# Altium schematic sheet Xbee_Avionics_Board.SchDoc: Xbee Avionics Board
size A3; Author: Adam R. Lehman / Daniel Mitchell; SheetNumber: 6; SheetTotal: 6
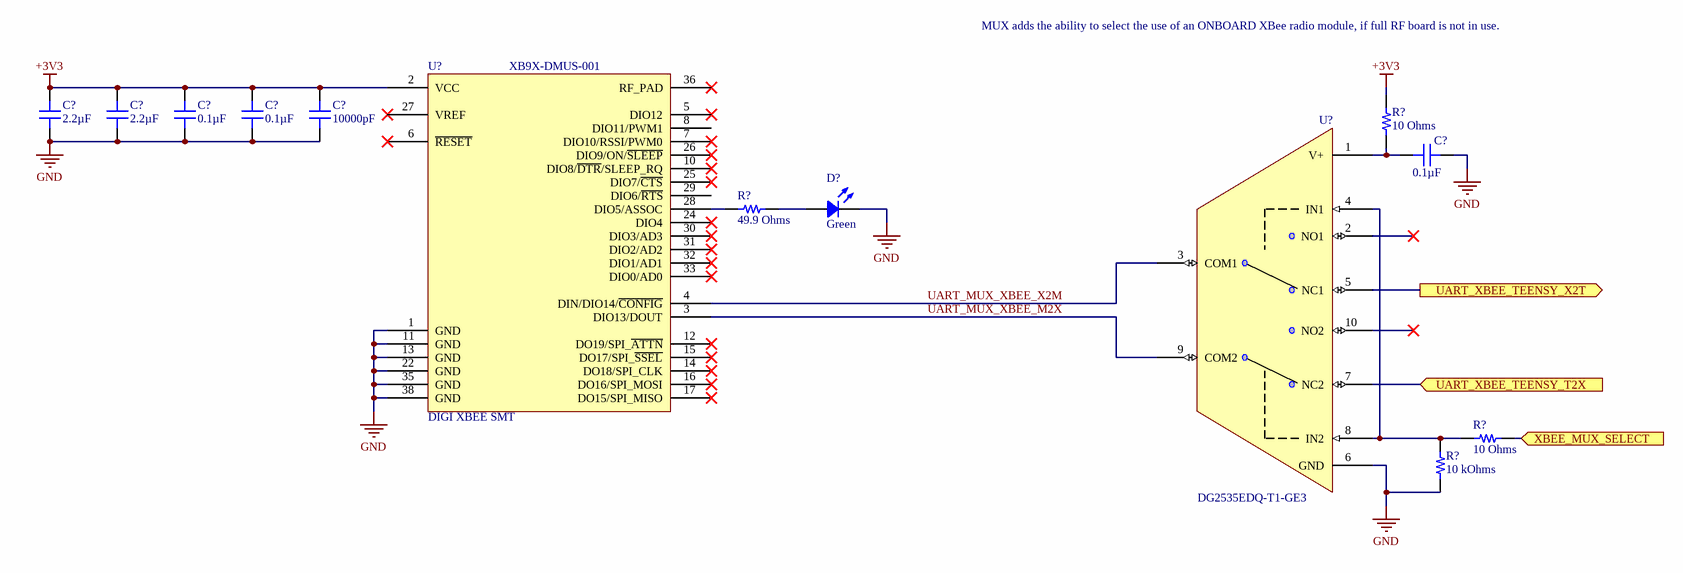
[diagram p0: Xbee_Avionics_Board.SchDoc]

## Parts
(Parts that share a designator on the sheet are numbered #1, #2 ... from top to bottom, then left to right.)
C?#1  2.2µF  [CAP 0603_1608]
C?#2  2.2µF  [CAP 0603_1608]
C?#3  0.1µF  [CAP 0603_1608]
C?#4  0.1µF  [CAP 0603_1608]
C?#5  10000pF  [CAP 0603_1608]
C?#6  0.1µF  [CAP 0603_1608]
D?  Green  [LED 0603_1608 GREEN]
R?#1  10 Ohms  [RES 0603_1608]
R?#2  49.9 Ohms  [RES 0603_1608]
R?#3  10 Ohms  [RES 0603_1608]
R?#4  10 kOhms  [RES 0603_1608]
U?#1  DIGI XBEE SMT  Part Number: XB9X-DMUS-001  [*XCVR_XBP9X-DMUS-001]
U?#2  DG2535EDQ-T1-GE3

## Ports
UART_XBEE_TEENSY_T2X (in), UART_XBEE_TEENSY_X2T (out), XBEE_MUX_SELECT (in)

## Nets
+3V3: C?#1.1 C?#2.1 C?#3.1 C?#4.1 C?#5.2 R?#1.2 U?#1.2(VCC)
GND: C?#1.2 C?#2.2 C?#3.2 C?#4.2 C?#5.1 C?#6.2 D?.2 R?#4.1 U?#1.1(GND) U?#1.11(GND) U?#1.13(GND) U?#1.22(GND) U?#1.35(GND) U?#1.38(GND) U?#2.6(GND)
UART_MUX_XBEE_M2X: U?#1.3(DIO13/DOUT) U?#2.9(COM2)
UART_MUX_XBEE_X2M: U?#1.4(DIN/DIO14/~{CONFIG}) U?#2.3(COM1)
UART_XBEE_TEENSY_T2X: U?#2.7(NC2) ; port UART_XBEE_TEENSY_T2X
UART_XBEE_TEENSY_X2T: U?#2.5(NC1) ; port UART_XBEE_TEENSY_X2T
XBEE_MUX_SELECT: R?#3.1 ; port XBEE_MUX_SELECT
NetC?#6_1: C?#6.1 R?#1.1 U?#2.1(V+)
NetD?_1: D?.1 R?#2.2
NetR?#2_1: R?#2.1 U?#1.28(DIO5/ASSOC)
NetR?#3_2: R?#3.2 R?#4.2 U?#2.4(IN1) U?#2.8(IN2)

Not connected (* = marked no-connect by the designer): U?#1 5(DIO12)* 6(~{RESET})* 7(DIO10/RSSI/PWM0)* 8(DIO11/PWM1) 10(DIO8/~{DTR}/SLEEP_RQ)* 12(DO19/SPI_~{ATTN})* 14(DO18/SPI_CLK)* 15(DO17/SPI_~{SSEL})* 16(DO16/SPI_MOSI)* 17(DO15/SPI_MISO)* 24(DIO4)* 25(DIO7/~{CTS})* 26(DIO9/ON/~{SLEEP})* 27(VREF)* 29(DIO6/~{RTS}) 30(DIO3/AD3)* 31(DIO2/AD2)* 32(DIO1/AD1)* 33(DIO0/AD0)* 36(RF_PAD)*; U?#2 2(NO1)* 10(NO2)*

## Notes on the sheet
- MUX adds the ability to select the use of an ONBOARD XBee radio module, if full RF board is not in use.
- Title
- Size:
- Date:
- A4
- Author
- Time:
- Sheet
- Revision:
- of
- RIT Space Exploration Team
- Rochester Institute of Technology
- 1 Lomb Memorial Drive
- Rochester, NY 14623
- https://spex.rit.edu
- File:

## Library data of the parts
C?#1 C?#2 = GRM188R71A225KE15D: CAP CER 2.2UF 10V X7R 0603; Manufacturer: Murata Electronics; Tolerance: ±10%; Part Number: GRM188R71A225KE15D; Value: 2.2µF; Applications: General Purpose; Capacitance: 2.2µF; ComponentLink1Description: Datasheet; ComponentLink1URL: https://www.murata.com/~/media/webrenewal/support/library/catalog/products/capacitor/mlcc/c02e.ashx?la=en-us; ComponentLink2Description: DigiKey Link; ComponentLink2URL: http://digikey.com/product-detail/en/murata-electronics/GRM188R71A225KE15D/490-4520-1-ND/1033279; Device Package: 0603 (1608 Metric); LastUpdated: 1/21/2020 12:02:07 AM; Lifecycle Status: Active; Minimum Order: 1; Mounting Type: Surface Mount, MLCC; Operating Temperature: -55°C ~ 125°C; Package / Case: 0603 (1608 Metric); Packaging: TapeAndReel; PartId: 3946; Part Status: Active; Price: 0.05; Series: GRM; Size / Dimension: 0.063" L x 0.031" W (1.60mm x 0.80mm); Supplier 1: DigiKey; Supplier Part Number 1: 490-4520-1-ND; Temperature Coefficient: X7R; Thickness (Max): 0.035" (0.90mm); Voltage - Rated: 10V
C?#3 C?#4 C?#6 = 100X14W104MV4T: CAP CER 0.1UF 10V X7R 0603; Manufacturer: Johanson Dielectrics Inc.; Tolerance: ±20%; Part Number: 100X14W104MV4T; Value: 0.1µF; Applications: Bypass, Decoupling; Capacitance: 0.1µF; ComponentLink1Description: Datasheet; ComponentLink1URL: https://www.johansondielectrics.com/downloads/x2y-filter-and-decoupling-capacitors.pdf; ComponentLink2Description: DigiKey Link; ComponentLink2URL: http://digikey.com/product-detail/en/johanson-dielectrics-inc/100X14W104MV4T/709-1101-1-ND/1655915; Device Package: 0603 (1608 Metric); Features: Low ESL (X2Y); LastUpdated: 1/21/2020 12:02:09 AM; Lifecycle Status: Active; Minimum Order: 1; Mounting Type: Surface Mount, MLCC; Operating Temperature: -55°C ~ 125°C; Package / Case: 0603 (1608 Metric); Packaging: TapeAndReel; PartId: 2680; Part Status: Active; Price: 0.11; Series: X2Y®; Size / Dimension: 0.064" L x 0.035" W (1.63mm x 0.89mm); Supplier 1: DigiKey; Supplier Part Number 1: 709-1101-1-ND; Temperature Coefficient: X7R; Thickness (Max): 0.026" (0.66mm); Voltage - Rated: 10V
C?#5 = C0603S103K4RACTU: CAP CER 10000PF 16V X7R 0603; Manufacturer: KEMET; Tolerance: ±10%; Part Number: C0603S103K4RACTU; Value: 10000pF; Applications: Boardflex Sensitive; Capacitance: 10000pF; ComponentLink1Description: Datasheet; ComponentLink1URL: https://api.kemet.com/component-edge/download/datasheet/C0603S103K4RACTU.pdf; ComponentLink2Description: DigiKey Link; ComponentLink2URL: http://digikey.com/product-detail/en/kemet/C0603S103K4RACTU/399-9135-1-ND/3522653; Device Package: 0603 (1608 Metric); Features: Floating Electrode; LastUpdated: 1/21/2020 12:02:08 AM; Lifecycle Status: Active; Minimum Order: 1; Mounting Type: Surface Mount, MLCC; Operating Temperature: -55°C ~ 125°C; Package / Case: 0603 (1608 Metric); Packaging: TapeAndReel; PartId: 3312; Part Status: Active; Price: 0.07; Series: SMD Comm X7R FE; Size / Dimension: 0.063" L x 0.031" W (1.60mm x 0.80mm); Supplier 1: DigiKey; Supplier Part Number 1: 399-9135-1-ND; Temperature Coefficient: X7R; Thickness (Max): 0.034" (0.87mm); Voltage - Rated: 16V
D? = LT Q39G-Q1OO-25-1: LED GREEN DIFFUSED 0603 SMD; Manufacturer: OSRAM Opto Semiconductors Inc.; Configuration: Standard; Current - Test: 5mA; Lens Color: White; Lens Size: 1.10mm x 0.80mm; Lens Style: Rectangle with Flat Top; Millicandela Rating: 175.5mcd; Viewing Angle: 170°, 130°; Voltage - Forward (Vf) (Typ): 2.85V; Wavelength - Dominant: 530nm; Wavelength - Peak: 525nm; Part Number: LT Q39G-Q1OO-25-1; Color: Green; ComponentLink1Description: Datasheet; ComponentLink1URL: https://dammedia.osram.info/media/resource/hires/osram-dam-2493418/LT%20Q39G.pdf; ComponentLink2Description: DigiKey Link; ComponentLink2URL: http://digikey.com/product-detail/en/osram-opto-semiconductors-inc/LT-Q39G-Q1OO-25-1/475-3442-1-ND/7908059; Device Package: 0603 (1608 Metric); Height (Max): 0.40mm; LastUpdated: 1/21/2020 3:12:08 AM; Lens Transparency: Diffused; Lifecycle Status: Active; Minimum Order: 1; Mounting Type: Surface Mount; Package / Case: 0603 (1608 Metric); Packaging: TapeAndReel; PartId: 689; Part Status: Active; Price: 0.08; Series: CHIPLED 0603; Size / Dimension: 1.60mm L x 0.80mm W; Supplier 1: DigiKey; Supplier Part Number 1: 475-3442-1-ND; Supplier Device Package: 0603; Value: Green
R?#1 R?#3 = CRGCQ0603F10R: CRGCQ 0603 10R 1%; Manufacturer: TE Connectivity Passive Product; Power (Watts): 0.1W, 1/10W; Temperature Coefficient: ±400ppm/°C; Part Number: CRGCQ0603F10R; Value: 10 Ohms; ComponentLink1Description: Datasheet; ComponentLink1URL: https://www.te.com/commerce/DocumentDelivery/DDEController?Action=srchrtrv&DocNm=1773204-3&DocType=DS&DocLang=English; ComponentLink2Description: DigiKey Link; ComponentLink2URL: http://digikey.com/product-detail/en/te-connectivity-passive-product/CRGCQ0603F10R/A129664CT-ND/8577496; Composition: Thick Film; Device Package: 0603 (1608 Metric); Features: Automotive AEC-Q200, Moisture Resistant; Height - Seated (Max): 0.022" (0.55mm); LastUpdated: 1/21/2020 12:16:31 AM; Lifecycle Status: Active; Minimum Order: 1; Number of Terminations: 2; Operating Temperature: -55°C ~ 155°C; Package / Case: 0603 (1608 Metric); Packaging: CutTape; PartId: 23975; Part Status: Active; Price: 0.10; Ratings: AEC-Q200; Resistance: 10 Ohms; Series: CRGCQ; Size / Dimension: 0.063" L x 0.031" W (1.60mm x 0.80mm); Supplier 1: DigiKey; Supplier Part Number 1: A129664CT-ND; Supplier Device Package: 0603; Tolerance: ±1%
R?#2 = RT0603FRE0749R9L: RES SMD 49.9 OHM 1% 1/10W 0603; Manufacturer: Yageo; Power (Watts): 0.1W, 1/10W; Temperature Coefficient: ±50ppm/°C; Part Number: RT0603FRE0749R9L; Value: 49.9 Ohms; ComponentLink1Description: Datasheet; ComponentLink1URL: https://www.yageo.com/upload/media/product/productsearch/datasheet/rchip/PYu-RT_1-to-0.01_RoHS_L_11.pdf; ComponentLink2Description: DigiKey Link; ComponentLink2URL: http://digikey.com/product-detail/en/yageo/RT0603FRE0749R9L/YAG5744CT-ND/7648621; Composition: Thin Film; Device Package: 0603 (1608 Metric); Height - Seated (Max): 0.022" (0.55mm); LastUpdated: 1/21/2020 12:24:38 AM; Lifecycle Status: Active; Minimum Order: 1; Number of Terminations: 2; Operating Temperature: -55°C ~ 155°C; Package / Case: 0603 (1608 Metric); Packaging: TapeAndReel; PartId: 5683; Part Status: Active; Price: 0.01; Resistance: 49.9 Ohms; Series: RT; Size / Dimension: 0.063" L x 0.031" W (1.60mm x 0.80mm); Supplier 1: DigiKey; Supplier Part Number 1: YAG5744CT-ND; Supplier Device Package: 0603; Tolerance: ±1%
R?#4 = RT0603DRD0710KL: RES SMD 10K OHM 0.5% 1/10W 0603; Manufacturer: Yageo; Power (Watts): 0.1W, 1/10W; Temperature Coefficient: ±25ppm/°C; Part Number: RT0603DRD0710KL; Value: 10 kOhms; ComponentLink1Description: Datasheet; ComponentLink1URL: https://www.yageo.com/upload/media/product/productsearch/datasheet/rchip/PYu-RT_1-to-0.01_RoHS_L_11.pdf; ComponentLink2Description: DigiKey Link; ComponentLink2URL: http://digikey.com/product-detail/en/yageo/RT0603DRD0710KL/311-10KDCT-ND/1035680; Composition: Thin Film; Device Package: 0603 (1608 Metric); Height - Seated (Max): 0.022" (0.55mm); LastUpdated: 1/21/2020 12:24:44 AM; Lifecycle Status: Active; Minimum Order: 1; Number of Terminations: 2; Operating Temperature: -55°C ~ 155°C; Package / Case: 0603 (1608 Metric); Packaging: TapeAndReel; PartId: 5487; Part Status: Active; Price: 0.02; Resistance: 10 kOhms; Series: RT; Size / Dimension: 0.063" L x 0.031" W (1.60mm x 0.80mm); Supplier 1: DigiKey; Supplier Part Number 1: 311-10KDCT-ND; Supplier Device Package: 0603; Tolerance: ±0.5%
U?#2 = DG2535EDQ-T1-GE3: Parameter 1: *; Part Number: DG2535EDQ-T1-GE3